# EasyEDA Pro project esp32_tools.eprj

# Schematic Schematic1
Create Date: 2024-05-25; Page Name: P1; Project Name: esp32_tools; Schematic Name: Schematic1; Update Date: 2024-06-01; Company: 嘉立创EDA; Page Size: A4; Version: V1.0
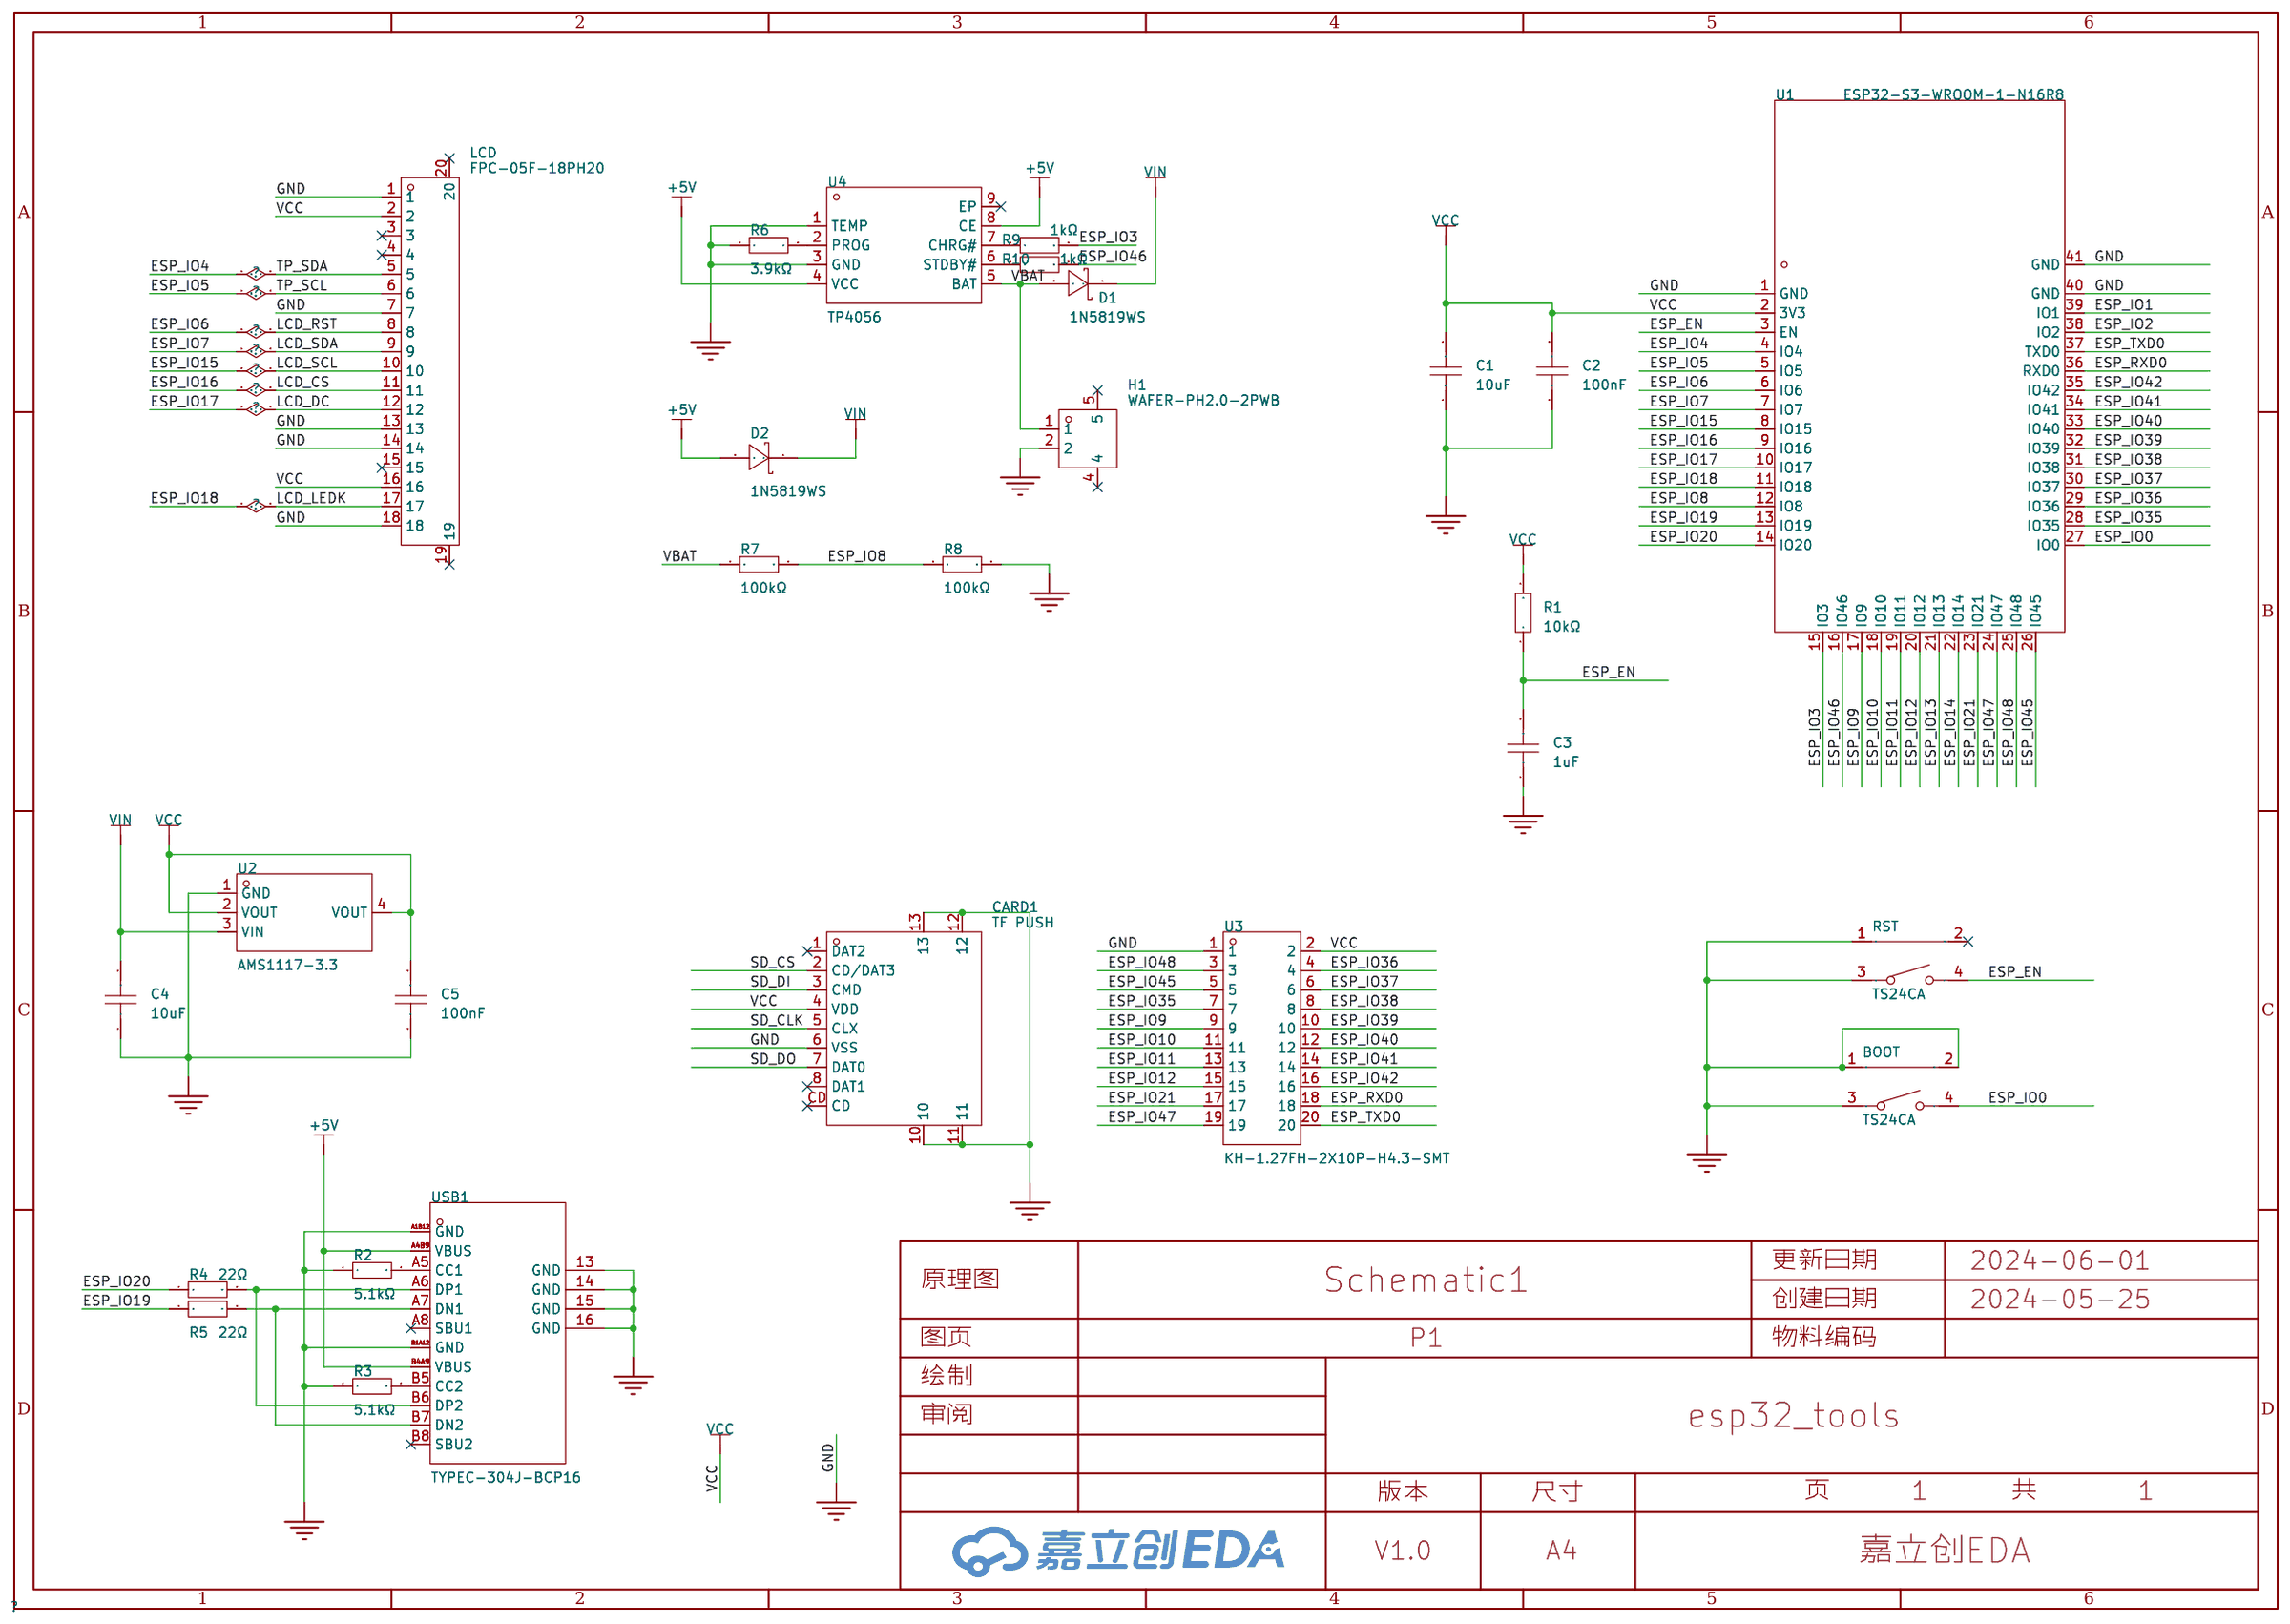
[diagram p0: schematic sheet]

## Parts
BOOT  TS24CA  [SW-SMD_TS24CA]
C1  10uF  [C0603]
C2  100nF  [C0603]
C3  1uF  [C0603]
C4  10uF  [C0603]
C5  100nF  [C0603]
CARD1  TF PUSH  [TF-SMD_TF-PUSH]
D1  1N5819WS  [SOD-323_L1.8-W1.3-LS2.5-RD]
D2  1N5819WS  [SOD-323_L1.8-W1.3-LS2.5-RD]
H1  WAFER-PH2.0-2PWB  [CONN-SMD_2P-P2.00_XUNPU_WAFER-PH2.0-2PWB]
LCD  FPC-05F-18PH20  [FPC-SMD_18P-P0.50_FPC-05F-18PH20]
R1  10kΩ  [R0603]
R2  5.1kΩ  [R0603]
R3  5.1kΩ  [R0603]
R4  22Ω  [R0603]
R5  22Ω  [R0603]
R6  3.9kΩ  [R0603]
R7  100kΩ  [R0603]
R8  100kΩ  [R0603]
R9  1kΩ  [R0603]
R10  1kΩ  [R0603]
RST  TS24CA  [SW-SMD_TS24CA]
U1  ESP32-S3-WROOM-1-N16R8  [WIRELM-SMD_ESP32-S3-WROOM-1]
U2  AMS1117-3.3  [SOT-223-3_L6.5-W3.4-P2.30-LS7.0-BR]
U3  KH-1.27FH-2X10P-H4.3-SMT  [CONN-SMD_20P-P1.27_KINGHELM_KH-1.27FH-2X10P-H4.3-SMT]
U4  TP4056  [ESOP-8_L4.9-W3.9-P1.27-LS6.0-BL-EP]
USB1  TYPEC-304J-BCP16  [USB-C-SMD_TYPEC-304J-BCP16]

## Library data of the parts
BOOT RST = TS24CA: 电路结构:单刀单掷;按钮形状:矩形按钮;安装方式:卧贴;开关长度:4.55mm;开关宽度:1.8mm;开关高度:3.5mm;触点电流:50mA;额定电压(DC):12V;带灯:-;机械寿命:-;; LCSC Part Name: 4.55*1.8*3.5mm 卧贴 轻触开关; Supplier Part: C393942; Manufacturer: SHOU HAN(首韩); Supplier Footprint: SMD; JLCPCB Part Class: 扩展库; Datasheet: https://atta.szlcsc.com/upload/public/pdf/source/20190521/C393942_591A9E318887EFA4274D34029981AD99.pdf; Supplier: LCSC; Circuit: 单刀单掷; Actuator Style: 矩形按钮; Mounting Style: 卧贴; Switch Length: 4.55mm; Switch Width: 1.8mm; Switch Height: 3.5mm; Contact Current: 50mA; Voltage Rating (DC): 12V
C1 = CL10A106MQ8NNNC: 容值:10uF;精度:±20%;额定电压:6.3V;材质(温度系数):X5R;; LCSC Part Name: 10uF ±20% 6.3V; Supplier Part: C1691; Manufacturer: SAMSUNG(三星); Supplier Footprint: 0603; JLCPCB Part Class: 扩展库; Datasheet: https://atta.szlcsc.com/upload/public/pdf/source/20160218/1457707763339.pdf; Supplier: LCSC; Tolerance: ±20%; Voltage Rated: 6.3V; Temperature Coefficient: X5R
C2 C5 = CC0603KRX7R9BB104: 容值:100nF;精度:±10%;额定电压:50V;材质(温度系数):X7R;; LCSC Part Name: 100nF ±10% 50V; Supplier Part: C14663; Manufacturer: YAGEO(国巨); Supplier Footprint: 0603; JLCPCB Part Class: 基础库; Datasheet: https://atta.szlcsc.com/upload/public/pdf/source/20180910/C282072_33301C7F631E79921B82A8DAC6BCC5B3.pdf; Supplier: LCSC; Tolerance: ±10%; Voltage Rated: 50V; Temperature Coefficient: X7R
C3 = CL10A105KB8NNNC: 容值:1uF;精度:±10%;额定电压:50V;材质(温度系数):X5R;; LCSC Part Name: 1uF ±10% 50V; Supplier Part: C15849; Manufacturer: SAMSUNG(三星); Supplier Footprint: 0603; JLCPCB Part Class: 基础库; Datasheet: https://atta.szlcsc.com/upload/public/pdf/source/20160218/1457707763339.pdf; Supplier: LCSC; Tolerance: ±10%; Voltage Rated: 50V; Temperature Coefficient: X5R
C4 = CL10A106MA8NRNC: 容值:10uF;精度:±20%;额定电压:25V;材质(温度系数):X5R;; LCSC Part Name: 10uF ±20% 25V; Supplier Part: C96446; Manufacturer: SAMSUNG(三星); Supplier Footprint: 0603; JLCPCB Part Class: 基础库; Datasheet: https://atta.szlcsc.com/upload/public/pdf/source/20160218/1457707763339.pdf; Supplier: LCSC; Tolerance: ±20%; Voltage Rated: 25V; Temperature Coefficient: X5R
CARD1 = TF PUSH: 卡连接方式:自弹式;卡类型:MicroSD卡(TF卡);连接器类型:卡座;本体最大高度:2mm;触头材质:-;触头镀层:-;工作温度范围:-20℃~+90℃;焊接温度(最大值):-;; LCSC Part Name: 自弹式 MicroSD卡(TF卡) 卡座; Supplier Part: C393941; Manufacturer: SHOU HAN(首韩); Supplier Footprint: SMD; JLCPCB Part Class: 扩展库; Datasheet: https://atta.szlcsc.com/upload/public/pdf/source/20191011/C393941_0DDD896EE907FEB750D8B7B8982E2A67.pdf; Supplier: LCSC; Card Connection Mode: 自弹式; Card Type: MicroSD卡(TF卡); Connector Type: 卡座; Maximum Body Height: 2mm; Operating Temperature Range: -20℃~+90℃; Additional Card Detection Pins: 无
D1 D2 = 1N5819WS_C191023: 正向压降(Vf):600mV@1A;直流反向耐压(Vr):40V;平均整流电流(Io):1A;; LCSC Part Name: 电压:40V 电流:1A; Supplier Part: C191023; Manufacturer: Hottech(合科泰); Supplier Footprint: SOD-323; JLCPCB Part Class: 基础库; Datasheet: https://atta.szlcsc.com/upload/public/pdf/source/20220428/3CB86FD8D28D653594B4E35F9D5AEFD9.pdf; Supplier: LCSC; Forward Voltage (Vf@If): 600mV@1A; Reverse Voltage (Vr): 40V; Average Rectified Current (Io): 1A
H1 = WAFER-PH2.0-2PWB: 插针结构:1x2P;间距:2mm;安装方式:卧贴;总PIN数:2P;排数:1;每排PIN数:2;额定电流:2A;工作温度范围:-25℃~+85℃;; LCSC Part Name: 1x2P 间距:2mm 卧贴; Supplier Part: C3029440; Manufacturer: XUNPU(讯普); Supplier Footprint: SMD,P=2mm,卧贴; JLCPCB Part Class: 扩展库; Datasheet: https://atta.szlcsc.com/upload/public/pdf/source/20220527/83903C18429EFE4C9EEE8C529A248431.pdf; Supplier: LCSC; Pins Structure: 1x2P; Pitch: 2mm; Mounting Style: 卧贴; Number of Pins: 2P; Number of Rows: 1; Number of PINs Per Row: 2; Current Rating (Max): 2A; Operating Temperature Range: -25℃~+85℃
LCD = FPC-05F-18PH20: 锁定特性:翻盖式;触点类型:下接;触点数量:18P;间距:0.5mm;安装类型:卧贴;工作温度范围:-25℃~+85℃;; LCSC Part Name: 间距:0.5mm P数:18P 翻盖式 下接; Supplier Part: C2856802; Manufacturer: XUNPU(讯普); Supplier Footprint: SMD,P=0.5mm,卧贴; JLCPCB Part Class: 扩展库; Datasheet: https://atta.szlcsc.com/upload/public/pdf/source/20210922/C2856802_2A845D1961F33AEC1ED22CECB292335F.pdf; Supplier: LCSC; Locking Feature: 翻盖式; Contact Type: 下接; Number of Contacts: 18P; Pitch: 0.5mm; Mounting Type: 卧贴; FFC, FCB Thickness: 0.3mm; Height Above Board: 2mm; Operating Temperature Range: -25℃~+85℃
R1 = 0603WAF1002T5E: 电阻类型:厚膜电阻;阻值:10kΩ;精度:±1%;功率:100mW;最大工作电压:75V;温度系数:±100ppm/℃;; LCSC Part Name: 厚膜电阻 10kΩ ±1% 100mW; Supplier Part: C25804; Manufacturer: UNI-ROYAL(厚声); Supplier Footprint: 0603; JLCPCB Part Class: 基础库; Datasheet: https://atta.szlcsc.com/upload/public/pdf/source/20200306/C422600_1E6D84923E4A46A82E41ADD87F860B5C.pdf; Supplier: LCSC; Type: 厚膜电阻; Tolerance: ±1%; Power(Watts): 100mW; Overload Voltage (Max): 75V; Temperature Coefficient: ±100ppm/℃; Operating Temperature Range: -55℃~+155℃
R2 R3 = 0603WAF5101T5E: 电阻类型:厚膜电阻;阻值:5.1kΩ;精度:±1%;功率:100mW;最大工作电压:75V;温度系数:±100ppm/℃;; LCSC Part Name: 5.1kΩ ±1% 100mW 厚膜电阻; Supplier Part: C23186; Manufacturer: UNI-ROYAL(厚声); Supplier Footprint: 0603; JLCPCB Part Class: 基础库; Datasheet: https://atta.szlcsc.com/upload/public/pdf/source/20200306/C422600_1E6D84923E4A46A82E41ADD87F860B5C.pdf; Supplier: LCSC; Type: 厚膜电阻; Tolerance: ±1%; Power(Watts): 100mW; Overload Voltage (Max): 75V; Temperature Coefficient: ±100ppm/℃; Operating Temperature Range: -55℃~+155℃
R4 R5 = 0603WAF220JT5E: 电阻类型:厚膜电阻;阻值:22Ω;精度:±1%;功率:100mW;最大工作电压:75V;温度系数:±100ppm/℃;; LCSC Part Name: 22Ω ±1% 100mW 厚膜电阻; Supplier Part: C23345; Manufacturer: UNI-ROYAL(厚声); Supplier Footprint: 0603; JLCPCB Part Class: 基础库; Datasheet: https://atta.szlcsc.com/upload/public/pdf/source/20200306/C422600_1E6D84923E4A46A82E41ADD87F860B5C.pdf; Supplier: LCSC; Type: 厚膜电阻; Tolerance: ±1%; Power(Watts): 100mW; Overload Voltage (Max): 75V; Temperature Coefficient: ±100ppm/℃; Operating Temperature Range: -55℃~+155℃
R6 = 0603WAF3901T5E: 电阻类型:厚膜电阻;阻值:3.9kΩ;精度:±1%;功率:100mW;最大工作电压:75V;温度系数:±100ppm/℃;; LCSC Part Name: 3.9kΩ ±1% 100mW 厚膜电阻; Supplier Part: C23018; Manufacturer: UNI-ROYAL(厚声); Supplier Footprint: 0603; JLCPCB Part Class: 基础库; Datasheet: https://atta.szlcsc.com/upload/public/pdf/source/20200306/C422600_1E6D84923E4A46A82E41ADD87F860B5C.pdf; Supplier: LCSC; Type: 厚膜电阻; Tolerance: ±1%; Power(Watts): 100mW; Overload Voltage (Max): 75V; Temperature Coefficient: ±100ppm/℃; Operating Temperature Range: -55℃~+155℃
R7 R8 = RC0603FR-07100KL: 电阻类型:厚膜电阻;阻值:100kΩ;精度:±1%;功率:100mW;最大工作电压:75V;温度系数:±100ppm/℃;; LCSC Part Name: 厚膜电阻 100kΩ ±1% 100mW; Supplier Part: C14675; Manufacturer: YAGEO(国巨); Supplier Footprint: 0603; JLCPCB Part Class: 扩展库; Datasheet: https://atta.szlcsc.com/upload/public/pdf/source/20140324/1457707028752.pdf; Supplier: LCSC; Type: 厚膜电阻; Tolerance: ±1%; Power(Watts): 100mW; Overload Voltage (Max): 75V; Temperature Coefficient: ±100ppm/℃; Operating Temperature Range: -55℃~+155℃
R9 R10 = RC0603FR-071KL: 电阻类型:厚膜电阻;阻值:1kΩ;精度:±1%;功率:100mW;最大工作电压:75V;温度系数:±100ppm/℃;; LCSC Part Name: 厚膜电阻 1kΩ ±1% 100mW; Supplier Part: C22548; Manufacturer: YAGEO(国巨); Supplier Footprint: 0603; JLCPCB Part Class: 扩展库; Datasheet: https://atta.szlcsc.com/upload/public/pdf/source/20180316/70C0E2BDAE7FCC62C531A5A58D202EE1.pdf; Supplier: LCSC; Type: 厚膜电阻; Tolerance: ±1%; Power(Watts): 100mW; Overload Voltage (Max): 75V; Temperature Coefficient: ±100ppm/℃; Operating Temperature Range: -55℃~+155℃
U1 = ESP32-S3-WROOM-1-N16R8: LCSC Part Name: 通用型Wi-Fi+低功耗蓝牙MCU模组; Supplier Part: C2913202; Manufacturer: ESPRESSIF(乐鑫); Supplier Footprint: SMD,18x25.5mm; JLCPCB Part Class: 扩展库; Datasheet: https://atta.szlcsc.com/upload/public/pdf/source/20220705/4E799F39581577F766659887F738A439.pdf; Supplier: LCSC
U2 = AMS1117-3.3_C6186: 输出类型:固定;最大输入电压:-;输出电压:3.3V;最大输出电流:1A;电源纹波抑制比(PSRR):72dB@(120Hz);输出极性:正极;; LCSC Part Name: 输出3.3V 1A; Supplier Part: C6186; Manufacturer: AMS; Supplier Footprint: SOT-223-3; JLCPCB Part Class: 基础库; Datasheet: https://atta.szlcsc.com/upload/public/pdf/source/20180727/C6186_7A095716F0823C02F1997A905E26C086.pdf; Supplier: LCSC; Output Type: 固定; Output Voltage: 3.3V; MAX Output Current: 1A; Power Supply Rejection Ratio (PSRR): 72dB@(120Hz); Dropout Voltage: 1.3V@(800mA); Output Polarity: 正极; Number of Outputs: 1
U3 = KH-1.27FH-2X10P-H4.3-SMT: 插孔结构:2x10P;间距:1.27mm;行距:1.27mm;圆孔/方孔:方孔;安装类型:立贴;排数:双排;总孔位数:20P;额定电流:1A;额定电压:-;插孔方向:顶部;塑高:4.3mm;工作温度范围:-40℃~+105℃;; LCSC Part Name: 间距:1.27mm 2x10P 立贴; Supplier Part: C2938399; Manufacturer: kinghelm(金航标); Supplier Footprint: SMD,P=1.27mm; JLCPCB Part Class: 扩展库; Datasheet: https://atta.szlcsc.com/upload/public/pdf/source/20211228/9EED874CCD66E53FBD3960CA18E93ED0.pdf; Supplier: LCSC; Holes Structure: 2x10P; Pitch: 1.27mm; Row Spacing: 1.27mm; Circular Hole / Square Hole: 方孔; Mounting Type: 立贴; Number of Rows: 双排; Number of Holes: 20P; Current Rating (Max): 1A; Holes Direction: 顶部; Insulation Height: 4.3mm; Operating Temperature Range: -40℃~+105℃
U4 = TP4056_C725790: Supplier Part: C725790; Manufacturer: UMW(友台半导体); Supplier Footprint: ESOP-8; JLCPCB Part Class: 扩展库; Datasheet: https://atta.szlcsc.com/upload/public/pdf/source/20231109/CF74897CE79A500F7FE27A45ADCCC631.pdf; Supplier: LCSC
USB1 = TYPEC-304J-BCP16: 连接器类型:Type-C;标准:USB 3.1;公母:母;端口数量:1;触点数量:16P;安装方式:卧贴;额定电流 - 电源:5A;工作温度范围:-40℃~+85℃;焊接温度(最大值):260℃;; LCSC Part Name: Type-C 母 卧贴; Supplier Part: C2835315; Manufacturer: XUNPU(讯普); Supplier Footprint: SMD; JLCPCB Part Class: 扩展库; Datasheet: https://atta.szlcsc.com/upload/public/pdf/source/20210528/C2835315_A76BD3CF9329D12B6041421AD23BFD66.pdf; Supplier: LCSC; Connector Type: Type-C; Standard: USB 3.1; Gender: 母; Number of Ports: 1; Number of Contacts: 16P; Mounting Style: 卧贴; Current Rating - Power (Max): 5A; Operating Temperature Range: -40℃~+85℃; Soldering Temperature(Max): 260℃

## Nets
+5V: D2.2(A) U4.4(VCC) U4.8(CE) USB1.A4B9(VBUS) USB1.B4A9(VBUS)
GND: BOOT.1 BOOT.2 BOOT.3 C1.1 C2.1 C3.1 C4.1 C5.1 CARD1.6(VSS) CARD1.10 CARD1.11 CARD1.12 CARD1.13 H1.2 LCD.1 LCD.7 LCD.13 LCD.14 LCD.18 R2.1 R3.1 R6.1 R8.2 RST.1 RST.3 U1.1(GND) U1.40(GND) U1.41(GND) U2.1(GND) U3.1 U4.1(TEMP) U4.3(GND) USB1.13(GND) USB1.14(GND) USB1.15(GND) USB1.16(GND) USB1.A1B12(GND) USB1.B1A12(GND)
VBAT: D1.2(A) H1.1 R7.1 U4.5(BAT)
VCC: C1.2 C2.2 C5.2 CARD1.4(VDD) LCD.2 LCD.16 R1.2 U1.2(3V3) U2.2(VOUT) U2.4(VOUT) U3.2
VIN: C4.2 D1.1(K) D2.1(K) U2.3(VIN)
ESP_EN: C3.2 R1.1 RST.4 U1.3(EN)
ESP_IO0: BOOT.4 U1.27(IO0)
ESP_IO1: U1.39(IO1)
ESP_IO2: U1.38(IO2)
ESP_IO3: R9.2 U1.15(IO3)
ESP_IO4: LCD.5 U1.4(IO4)
ESP_IO5: LCD.6 U1.5(IO5)
ESP_IO6: LCD.8 U1.6(IO6)
ESP_IO7: LCD.9 U1.7(IO7)
ESP_IO8: R7.2 R8.1 U1.12(IO8)
ESP_IO9: U1.17(IO9) U3.9
ESP_IO10: U1.18(IO10) U3.11
ESP_IO11: U1.19(IO11) U3.13
ESP_IO12: U1.20(IO12) U3.15
ESP_IO13: U1.21(IO13)
ESP_IO14: U1.22(IO14)
ESP_IO15: LCD.10 U1.8(IO15)
ESP_IO16: LCD.11 U1.9(IO16)
ESP_IO17: LCD.12 U1.10(IO17)
ESP_IO18: LCD.17 U1.11(IO18)
ESP_IO19: R5.1 U1.13(IO19)
ESP_IO20: R4.1 U1.14(IO20)
ESP_IO21: U1.23(IO21) U3.17
ESP_IO35: U1.28(IO35) U3.7
ESP_IO36: U1.29(IO36) U3.4
ESP_IO37: U1.30(IO37) U3.6
ESP_IO38: U1.31(IO38) U3.8
ESP_IO39: U1.32(IO39) U3.10
ESP_IO40: U1.33(IO40) U3.12
ESP_IO41: U1.34(IO41) U3.14
ESP_IO42: U1.35(IO42) U3.16
ESP_IO45: U1.26(IO45) U3.5
ESP_IO46: R10.2 U1.16(IO46)
ESP_IO47: U1.24(IO47) U3.19
ESP_IO48: U1.25(IO48) U3.3
ESP_RXD0: U1.36(RXD0) U3.18
ESP_TXD0: U1.37(TXD0) U3.20
SD_CLK: CARD1.5(CLX)
SD_CS: CARD1.2(CD/DAT3)
SD_DI: CARD1.3(CMD)
SD_DO: CARD1.7(DAT0)
$1N2450: R2.2 USB1.A5(CC1)
$1N2489: R3.2 USB1.B5(CC2)
$1N2560: R5.2 USB1.A7(DN1) USB1.B7(DN2)
$1N2569: R4.2 USB1.A6(DP1) USB1.B6(DP2)
$1N7946: R6.2 U4.2(PROG)
$1N8576: R9.1 U4.7(CHRG#)
$1N8615: R10.1 U4.6(STDBY#)

Not connected (* = marked no-connect by the designer): CARD1 1(DAT2)* 8(DAT1)* CD*; H1 4* 5*; LCD 3* 4* 15* 19* 20*; RST 2*; U4 9(EP)*; USB1 A8(SBU1)* B8(SBU2)*

# Board PCB1
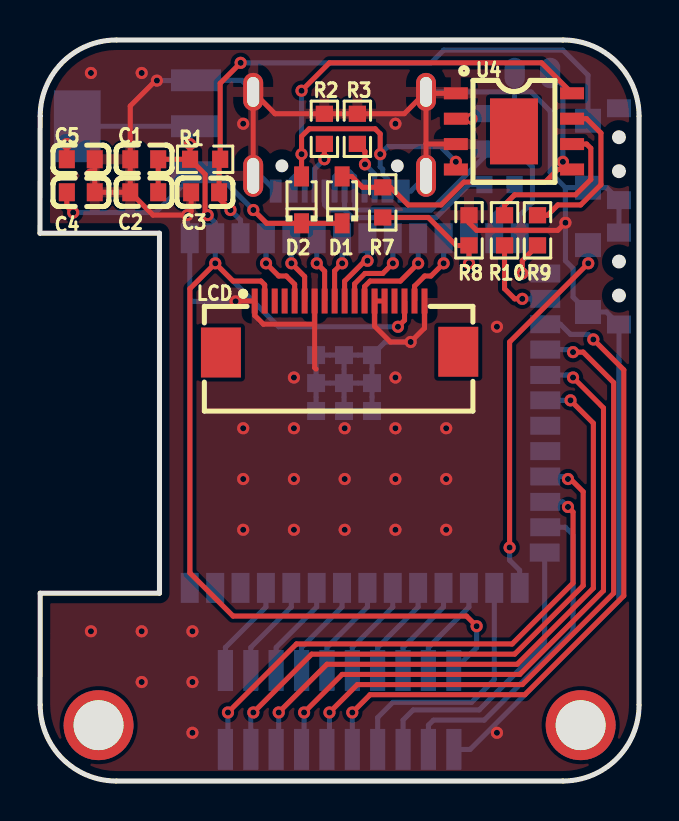
[diagram p1: board, top side]
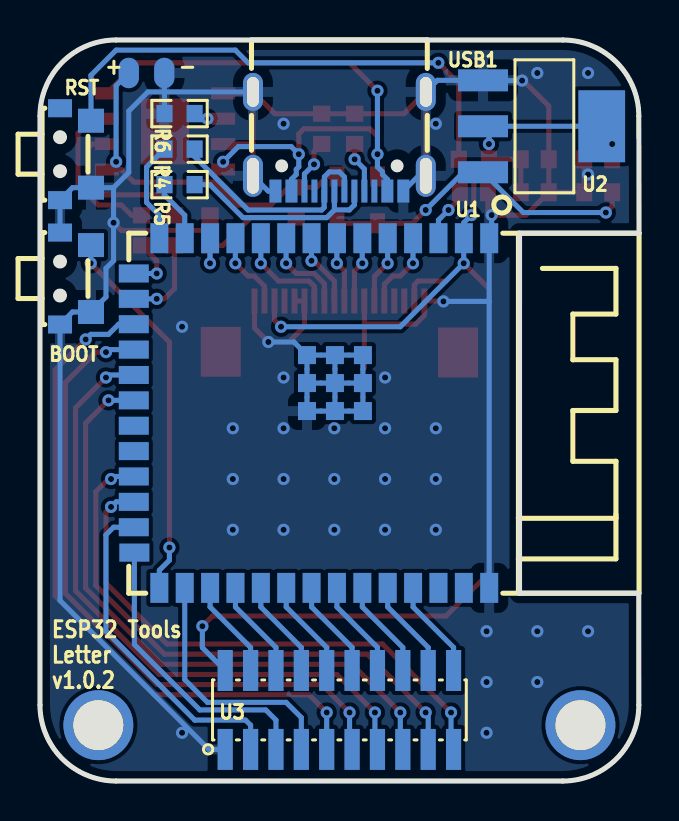
[diagram p2: board, bottom side, seen from below]

Outline 29.99 x 37.09 mm; copper layers: Top Layer, Bottom Layer. Coordinates in mm from the lower left corner of the outline.
Outline path: 0,27.42 0.01,33.28 arc(1.13,35.97) 3.82,37.09 26.18,37.09 arc(28.87,35.97) 29.99,33.28 29.99,3.81 arc(28.87,1.12) 26.18,0 3.82,0 arc(1.13,1.12) 0.01,3.81 0.01,9.4 5.98,9.4 5.98,27.42 0,27.42
Stack: Top Layer 0.035mm / Dielectric1 1.51mm FR4 er 4.5 / Bottom Layer 0.035mm

## Design rules (mm)
template: 自定义配置
spacing copperThickness1oz (default): track to track 0.102, other pairs 0.152 to 0.3
spacing copperThickness2oz: track to track 0.203, other pairs 0.152 to 0.3
track width copperThickness1oz (default): min 0.127, default 0.254, max 2.54
track width copperThickness2oz: min 0.203, default 0.254, max 2.54
differential pair differentialPair (default): width min 0.127, default 0.254, max 2.54; gap min 0.152, default 0.152
via viaSize (default): diameter min 0.5, default 0.61, max 35; hole min 0.3, default 0.305, max 45

## Placement (name value [footprint] x y rotation side)
BOOT  TS24CA  [SW-SMD_TS24CA]  28.21 25.15 90 bottom
C1  10uF  [C0603]  5.22 31.12 0 top
C2  100nF  [C0603]  5.22 29.47 0 top
C3  1uF  [C0603]  8.27 29.47 0 top
C4  10uF  [C0603]  2.04 29.47 180 top
C5  100nF  [C0603]  2.04 31.12 180 top
D1  1N5819WS  [SOD-323_L1.8-W1.3-LS2.5-RD]  15.12 29.08 90 top
D2  1N5819WS  [SOD-323_L1.8-W1.3-LS2.5-RD]  13.09 29.08 90 top
LCD  FPC-05F-18PH20  [FPC-SMD_18P-P0.50_FPC-05F-18PH20]  15 22.73 0 top
NOREF  -  [Pad_e707]  25.54 35.43 0 top
NOREF#2  -  [Pad_e46]  2.93 2.8 0 top
NOREF#3  -  [Pad_e709]  23.76 35.43 0 top
NOREF#4  -  [Pad_e149]  27.06 2.8 0 top
R1  10kΩ  [R0603]  8.27 31.12 180 top
R2  5.1kΩ  [R0603]  14.24 32.64 270 top
R3  5.1kΩ  [R0603]  15.89 32.64 270 top
R4  22Ω  [R0603]  23 31.62 180 bottom
R5  22Ω  [R0603]  23 29.85 180 bottom
R6  3.9kΩ  [R0603]  23 33.4 180 bottom
R7  100kΩ  [R0603]  17.16 28.96 270 top
R8  100kΩ  [R0603]  21.47 27.56 90 top
R9  1kΩ  [R0603]  24.9 27.56 270 top
R10  1kΩ  [R0603]  23.25 27.56 270 top
RST  TS24CA  [SW-SMD_TS24CA]  28.21 31.37 90 bottom
U1  ESP32-S3-WROOM-1-N16R8  [WIRELM-SMD_ESP32-S3-WROOM-1]  16.4 18.42 270 bottom
U2  AMS1117-3.3  [SOT-223-3_L6.5-W3.4-P2.30-LS7.0-BR]  4.84 32.77 0 bottom
U3  KH-1.27FH-2X10P-H4.3-SMT  [CONN-SMD_20P-P1.27_KINGHELM_KH-1.27FH-2X10P-H4.3-SMT]  15 3.56 180 bottom
U4  TP4056  [ESOP-8_L4.9-W3.9-P1.27-LS6.0-BL-EP]  23.72 32.51 270 top
USB1  TYPEC-304J-BCP16  [USB-C-SMD_TYPEC-304J-BCP16]  15 32.01 0 bottom

## Footprints (pads in the part's own frame, mm; a bottom-side part is the same pattern mirrored in y, then rotated)
C0603
  rect 0.8x0.9 smd: 1(-0.7,0) 2(0.7,0)
CONN-SMD_20P-P1.27_KINGHELM_KH-1.27FH-2X10P-H4.3-SMT
  rect 0.76x2.05 smd: 1(-5.715,-1.975) 2(-5.715,1.975) 3(-4.445,-1.975) 4(-4.445,1.975) 5(-3.175,-1.975) 6(-3.175,1.975) 7(-1.905,-1.975) 8(-1.905,1.975) 9(-0.635,-1.975) 10(-0.635,1.975) 11(0.635,-1.975) 12(0.635,1.975) 13(1.905,-1.975) 14(1.905,1.975) 15(3.175,-1.975) 16(3.175,1.975) 17(4.445,-1.975) 18(4.445,1.975) 19(5.715,-1.975) 20(5.715,1.975)
ESOP-8_L4.9-W3.9-P1.27-LS6.0-BL-EP
  rect 0.6x1.2 smd: 1(-1.905,-2.909) 2(-0.635,-2.909) 3(0.635,-2.909) 4(1.905,-2.909) 5(1.905,2.909) 6(0.635,2.909) 7(-0.635,2.909) 8(-1.905,2.909)
  rect 3.3x2.4 smd: 9(0,0)
FPC-SMD_18P-P0.50_FPC-05F-18PH20
  rect 0.3x1.25 smd: 1(-4.25,1.288) 2(-3.75,1.288) 3(-3.25,1.288) 4(-2.75,1.288) 5(-2.25,1.288) 6(-1.75,1.288) 7(-1.25,1.288) 8(-0.75,1.288) 9(-0.25,1.288) 10(0.25,1.288) 11(0.75,1.288) 12(1.25,1.288) 13(1.75,1.288) 14(2.25,1.288) 15(2.75,1.288) 16(3.25,1.288) 17(3.75,1.288) 18(4.25,1.288)
  rect 2x2.5 smd: 19(-5.94,-1.288) 20(5.94,-1.252)
Pad_e46
  round 3.5 hole 2.5: 42(0,0)
Pad_e149
  round 3.5 hole 2.5: 42(0,0)
Pad_e707
  oval 1.016x1.524 smd far side: 1(0,0)
Pad_e709
  oval 1.016x1.524 smd far side: 1(0,0)
R0603
  rect 0.806x0.864 smd: 1(-0.753,0) 2(0.753,0)
SOD-323_L1.8-W1.3-LS2.5-RD
  rect 1x0.75 smd: 1(-1.173,0) 2(1.173,0)
SOT-223-3_L6.5-W3.4-P2.30-LS7.0-BR
  rect 2.5x1.1 smd: 1(2.97,-2.3) 2(2.97,0) 3(2.97,2.3)
  rect 2.34x3.6 smd: 4(-2.97,0)
SW-SMD_TS24CA
  rect 0.9x1.2 smd: 1(-2.3,0.775) 2(2.3,0.775)
  rect 1.2x1.3 smd: 3(-1.675,-0.775) 4(1.675,-0.775)
USB-C-SMD_TYPEC-304J-BCP16
  oval 1x2.1 hole 0.6x1.8: 13(-4.325,1.718) 14(4.325,1.718)
  oval 1x1.9 hole 0.6x1.5: 15(-4.325,-2.482) 16(4.325,-2.482)
  rect 0.6x1.15 smd: A1B12(-3.2,2.482) A4B9(-2.4,2.482) B1A12(3.2,2.482) B4A9(2.4,2.482)
  rect 0.3x1.15 smd: A5(-1.25,2.482) A6(-0.25,2.482) A7(0.25,2.482) A8(1.25,2.482) B5(1.75,2.482) B6(0.75,2.482) B7(-0.75,2.482) B8(-1.75,2.482)
WIRELM-SMD_ESP32-S3-WROOM-1
  rect 1.5x0.9 smd: 1(-8.75,8.895) 2(-8.75,7.625) 3(-8.75,6.355) 4(-8.75,5.085) 5(-8.75,3.815) 6(-8.75,2.545) 7(-8.75,1.275) 8(-8.75,0.005) 9(-8.75,-1.265) 10(-8.75,-2.535) 11(-8.75,-3.805) 12(-8.75,-5.075) 13(-8.75,-6.345) 14(-8.75,-7.615) 27(8.75,-7.615) 28(8.75,-6.345) 29(8.75,-5.075) 30(8.75,-3.805) 31(8.75,-2.535) 32(8.75,-1.265) 33(8.75,0.005) 34(8.75,1.275) 35(8.75,2.545) 36(8.75,3.815) 37(8.75,5.085) 38(8.75,6.355) 39(8.75,7.625) 40(8.75,8.895)
  rect 0.9x1.5 smd: 15(-6.985,-8.895) 16(-5.715,-8.895) 17(-4.445,-8.895) 18(-3.175,-8.895) 19(-1.905,-8.895) 20(-0.635,-8.895) 21(0.635,-8.895) 22(1.905,-8.895) 23(3.175,-8.895) 24(4.445,-8.895) 25(5.715,-8.895) 26(6.985,-8.865)
  rect 0.9x0.9 smd: 41(-2.9,-0.225) 41(-2.9,1.175) 41(-2.9,2.575) 41(-1.5,-0.225) 41(-1.5,1.175) 41(-1.5,2.575) 41(-0.1,-0.225) 41(-0.1,1.175) 41(-0.1,2.575)

## Nets
As in the schematic, except:
GND: BOOT.1 BOOT.2 BOOT.3 C1.1 C2.1 C3.1 C4.1 C5.1 LCD.1 LCD.7 LCD.13 LCD.14 LCD.18 NOREF#3.1 R2.1 R3.1 R6.1 R8.2 RST.1 RST.3 U1.1 U1.40 U1.41 U2.1 U3.1 U4.1 U4.3 USB1.13 USB1.14 USB1.15 USB1.16 USB1.A1B12 USB1.B1A12
VBAT: D1.2 NOREF.1 R7.1 U4.5

Pads without a net: LCD 3 4 15 19 20; NOREF#2 42; NOREF#4 42; RST 2; U4 9; USB1 A8 B8

## Via types
v1: diameter 0.61, hole 0.305, Top Layer to Bottom Layer, 78 vias

## Routing (per net, layer and track width the routed paths; a pad name or vN(x,y) marks a point on that pad's centre or on a via; arc(x,y) is an arc through that point)
+5V: length 33.8
  Top Layer w0.254: U4.4 v1(20.82,30.99) ; v1(13.09,34.55) 14.49,35.94 25.11,35.94 U4.8 ; v1(17.03,31.37) 17.03,32.39 16.78,32.64 13.47,32.64 13.09,32.26 v1(13.09,31.37) D2.2
  Bottom Layer w0.254: v1(20.82,30.99) 20.06,31.75 17.41,31.75 v1(17.03,31.37) 17.03,30.74 17.16,30.61 17.16,30.35 17.4,30.11 USB1.B4A9 ; USB1.A4B9 12.59,29.54 12.59,30.1 12.84,30.35 12.84,30.48 13.09,30.74 v1(13.09,31.37) v1(13.09,34.55)
GND: length 154.1
  Top Layer w0.254: USB1.13 USB1.15 11.77,33.39 R2.1 R3.1 18.23,33.39 19.32,34.49 ; 13.75,22.86 13.75,20.69 13.82,20.62 ; 13.75,22.86 13.74,22.86 11.19,22.86 10.75,23.3 LCD.1 9.81,24.02 v1(9.79,24) ; 13.75,22.86 LCD.7 ; U4.1 19.39,34.42 19.32,34.49 ; C3.1 7.57,28.51 v1(7.38,28.32) 5.66,28.32 C2.1 ; C5.1 C4.1 C2.1 ; v1(5.85,35.05) 5.79,35.05 4.52,33.78 C1.1 C2.1 ; 19.32,31.89 19.34,31.88 U4.3 ; 19.32,31.89 19.32,30.29 ; 19.32,31.89 19.32,34.49 ; R8.2 21.47,27.94 21.86,27.56 25.92,27.56 v1(26.3,27.94) ; LCD.18 19.25,22.67 v1(18.55,21.97) 17.54,21.97 16.75,22.76 LCD.13 LCD.14
  Bottom Layer w0.254: U1.41 U1.41 U1.41 ; U1.41 U1.41 ; U1.41 U1.41 U1.41 ; 23.76,34.49 23.76,34.48 23.75,34.47 R6.1 ; 23.76,34.49 NOREF#3.1 ; 23.76,34.49 24.58,34.49 25.54,33.53 25.54,30.46 26.3,29.7 ; U1.41 U1.41 ; U1.41 U1.41 ; U1.41 17.28,21.97 v1(18.55,21.97) ; U1.41 U1.41 U1.41 ; U1.41 U1.41 ; U1.41 U1.41 ; v1(7.38,28.32) 7.38,27.29 U1.1 7.5,24 ; 23.74,34.49 19.32,34.49 ; 26.3,29.7 28.36,29.7 RST.1 BOOT.2 ; 26.3,29.7 v1(26.3,27.94) 26.3,26.04 26.68,25.66 26.68,24.22 27.43,23.47 28.36,23.47 BOOT.1 28.98,9.03 21.53,1.58 U3.1 ; U1.41 U1.41 ; v1(9.79,24) 7.5,24 ; 7.5,24 U1.40 ; USB1.B1A12 18.56,29.52 19.32,30.29 ; USB1.A1B12 11.03,30.29 USB1.13 ; USB1.15 10.09,35.07 U2.1 7.79,35.05 v1(5.85,35.05)
  vias: v1(2.55,35.43) v1(2.55,30.35) v1(2.55,7.49) v1(5.09,35.43) v1(5.09,7.49) v1(5.09,4.95) v1(7.63,7.49) v1(7.63,4.95) v1(7.63,2.41) v1(10.17,32.89) v1(10.17,17.65) v1(10.17,15.11) v1(10.17,12.57) v1(12.71,20.19) v1(12.71,17.65) v1(12.71,15.11) v1(12.71,12.57) v1(15.25,17.65) v1(15.25,15.11) v1(15.25,12.57) v1(17.79,32.89) v1(17.79,20.19) v1(17.79,17.65) v1(17.79,15.11) v1(17.79,12.57) v1(20.33,17.65) v1(20.33,15.11) v1(20.33,12.57) v1(22.87,22.73) v1(22.87,2.41)
VBAT: length 18.1
  Top Layer w0.254: D1.2 15.6,30.26 16.15,29.71 R7.1 17.55,29.71 18.43,28.83 20.08,28.83 21.22,29.97 25.28,29.97 25.92,30.61 26.56,30.61 ; 26.56,30.61 U4.5 ; 26.56,30.61 v1(26.17,30.99)
  Bottom Layer w0.254: v1(26.17,30.99) 26.17,34.8 NOREF.1
VCC: length 68.3
  Top Layer w0.254: v1(8.39,28.32) 8.27,28.45 8.27,30.36 R1.2 ; R1.2 v1(7.51,31.88) ; R1.2 5.92,31.12 5.92,29.47 ; v1(21.86,7.75) 21.35,8.26 9.66,8.26 7.5,10.42 7.5,24.64 v1(8.78,25.91) 9.66,25.02 11.06,25.02 11.25,24.83 LCD.2 ; v1(17.92,22.73) 18.25,23.06 LCD.16 ; C5.2 v1(1.34,31.88)
  Bottom Layer w0.254: v1(8.39,28.32) 8.77,27.95 U1.2 8.78,27.16 v1(8.78,25.91) 11.95,22.73 v1(17.92,22.73) ; v1(1.34,31.88) 1.34,32.24 U2.4 U2.2 7.5,32.46 7.5,31.88 v1(7.51,31.88) ; 20.71,5.53 21.86,6.68 v1(21.86,7.75)
VIN: length 16.5
  Top Layer w0.254: C4.2 1.34,28.77 v1(1.66,28.45) ; D1.1 D2.1 11.34,27.91 v1(10.68,28.58)
  Bottom Layer w0.254: v1(10.68,28.58) 8.79,30.47 U2.3 5.79,28.45 v1(1.66,28.45)
ESP_EN: length 30.1
  Top Layer w0.254: v1(9.54,28.58) 8.97,29.15 8.97,31.06 R1.1 9.02,34.92 v1(10.04,35.94)
  Bottom Layer w0.254: v1(9.54,28.58) 10.04,28.07 U1.3 ; v1(10.04,35.94) 19.57,35.94 20.21,36.58 26.17,36.58 27.43,35.32 27.43,33.05
ESP_IO0: length 19
  Top Layer w0.254: v1(27.44,25.91) 23.51,21.97 v1(23.51,11.69)
  Bottom Layer w0.254: v1(23.51,11.69) 23.51,11.05 24.01,10.55 U1.27 ; v1(27.44,25.91) 27.44,26.81 27.43,26.82
ESP_IO3: length 2.9
  Top Layer w0.254: v1(24.14,25.4) 24.14,26.05 R9.2
  Bottom Layer w0.254: U1.15 v1(24.14,25.4)
ESP_IO4: length 4
  Top Layer w0.254: LCD.5 12.75,24.86 12.33,25.27 11.95,25.27 v1(11.31,25.91)
  Bottom Layer w0.254: v1(11.31,25.91) 11.31,27.16 U1.4
ESP_IO5: length 3.4
  Top Layer w0.254: LCD.6 13.25,25.25 v1(12.59,25.91)
  Bottom Layer w0.254: U1.5 12.59,27.16 v1(12.59,25.91)
ESP_IO6: length 3.3
  Top Layer w0.254: LCD.8 14.25,25.52 v1(13.85,25.91)
  Bottom Layer w0.254: U1.6 13.85,27.16 v1(13.85,25.91)
ESP_IO7: length 3.3
  Top Layer w0.254: v1(15.12,25.91) 14.75,25.53 LCD.9
  Bottom Layer w0.254: v1(15.12,25.91) 15.12,27.16 U1.7
ESP_IO8: length 7.1
  Top Layer w0.254: 21.47,26.8 21.47,26.79 v1(21.47,25.91) ; 21.47,26.8 R8.1 ; 21.47,26.8 20.84,26.8 19.43,28.2 R7.2
  Bottom Layer w0.254: v1(21.47,25.91) 21.47,27.16 U1.12
ESP_IO9: length 34
  Top Layer w0.254: v1(27.7,22.1) 29.22,20.58 29.22,9.27 24.27,4.32 16.52,4.32 v1(15.63,3.43)
  Bottom Layer w0.254: U1.17 26.05,22.86 26.56,22.35 27.44,22.35 v1(27.7,22.1) ; U3.9 v1(15.63,3.43)
ESP_IO10: length 33.2
  Top Layer w0.254: v1(26.68,21.46) 27.19,21.46 28.71,19.94 28.71,9.4 24.14,4.83 15.89,4.83 v1(14.49,3.43)
  Bottom Layer w0.254: U1.18 26.56,21.59 v1(26.68,21.46) ; U3.11 14.49,1.71 v1(14.49,3.43)
ESP_IO11: length 32.2
  Top Layer w0.254: v1(13.22,3.43) 15.12,5.34 24.01,5.34 28.21,9.53 28.21,18.67 v1(26.68,20.19)
  Bottom Layer w0.254: v1(26.68,20.19) 26.56,20.32 U1.19 ; U3.13 13.22,1.71 v1(13.22,3.43)
ESP_IO12: length 31.4
  Top Layer w0.254: v1(26.56,19.05) 27.7,17.91 27.7,9.65 23.89,5.84 14.36,5.84 v1(11.95,3.43)
  Bottom Layer w0.254: v1(26.56,19.05) U1.20 ; v1(11.95,3.43) 11.95,1.71 11.82,1.58
ESP_IO15: length 3.7
  Top Layer w0.254: v1(16.4,26.04) 16.27,26.04 15.25,25.02 LCD.10
  Bottom Layer w0.254: U1.8 16.4,27.16 v1(16.4,26.04)
ESP_IO16: length 4.5
  Top Layer w0.254: LCD.11 15.75,24.88 16.27,25.4 17.16,25.4 v1(17.66,25.91)
  Bottom Layer w0.254: U1.9 17.66,27.16 v1(17.66,25.91)
ESP_IO17: length 5.1
  Top Layer w0.254: v1(18.93,25.91) 18.04,25.02 16.52,25.02 16.25,24.75 LCD.12
  Bottom Layer w0.254: U1.10 v1(18.93,25.91)
ESP_IO18: length 3.9
  Top Layer w0.254: LCD.17 18.75,24.77 19.26,25.27 19.57,25.27 v1(20.21,25.91)
  Bottom Layer w0.254: v1(20.21,25.91) 20.21,27.16 U1.11
ESP_IO19: length 3.1
  Bottom Layer w0.254: U1.13 22.74,28.32 23.76,29.34 23.75,29.35 R5.1
ESP_IO20: length 5.1
  Bottom Layer w0.254: U1.14 24.01,27.17 24.01,28.32 24.65,28.96 24.65,30.73 R4.1
ESP_IO21: length 28
  Top Layer w0.254: v1(10.68,3.43) 13.6,6.35 23.76,6.35 27.19,9.78 27.19,14.48 26.56,15.11 v1(26.43,15.11)
  Bottom Layer w0.254: U1.23 26.3,15.24 v1(26.43,15.11) ; v1(10.68,3.43) 10.55,3.3 U3.17
ESP_IO35: length 12.8
  Bottom Layer w0.254: U1.28 22.74,5.08 21.6,3.94 17.66,3.94 16.9,3.18 U3.7
ESP_IO36: length 5
  Bottom Layer w0.254: 19.44,5.53 19.44,6.68 21.47,8.71 U1.29
ESP_IO37: length 5
  Bottom Layer w0.254: U1.30 20.2,8.71 18.17,6.68 18.17,5.53
ESP_IO38: length 5
  Bottom Layer w0.254: U1.31 18.93,8.71 16.9,6.68 16.9,5.53
ESP_IO39: length 5
  Bottom Layer w0.254: 15.63,5.53 15.63,6.68 17.66,8.71 U1.32
ESP_IO40: length 5
  Bottom Layer w0.254: U1.33 16.39,8.71 14.36,6.68 14.36,5.53
ESP_IO41: length 5
  Bottom Layer w0.254: 13.09,5.53 13.09,6.68 15.12,8.71 U1.34
ESP_IO42: length 5
  Bottom Layer w0.254: U1.35 13.85,8.71 11.82,6.68 11.82,5.53
ESP_IO45: length 14.7
  Bottom Layer w0.254: U1.26 25.26,6.83 21.98,3.56 18.68,3.56 18.17,3.05 U3.5
ESP_IO46: length 4.4
  Top Layer w0.254: v1(24.14,24.13) 23.76,24.13 23.25,24.64 R10.2
  Bottom Layer w0.254: v1(24.14,24.13) U1.16
ESP_IO47: length 27
  Top Layer w0.254: v1(26.43,13.72) 26.68,13.46 26.68,9.91 23.63,6.86 12.84,6.86 v1(9.41,3.43)
  Bottom Layer w0.254: v1(9.41,3.43) 9.41,1.71 U3.19 ; v1(26.43,13.72) 26.17,13.97 U1.24
ESP_IO48: length 16.8
  Bottom Layer w0.254: U1.25 26.3,12.7 26.68,12.32 26.68,7.49 22.24,3.05 19.7,3.05 19.44,2.8 19.44,1.58
ESP_RXD0: length 5
  Bottom Layer w0.254: 10.55,5.53 10.55,6.68 12.58,8.71 U1.36
ESP_TXD0: length 5
  Bottom Layer w0.254: U1.37 11.31,8.71 9.28,6.68 9.28,5.53
$1N2450: length 2.6
  Top Layer w0.254: v1(14.24,31.12) R2.2
  Bottom Layer w0.254: USB1.A5 13.75,30.63 v1(14.24,31.12)
$1N2489: length 2.7
  Top Layer w0.254: R3.2 16.27,31.51 v1(16.27,30.86)
  Bottom Layer w0.254: v1(16.27,30.86) 16.75,30.38 USB1.B5
$1N2560: length 10.6
  Bottom Layer w0.254: R5.2 21.47,29.85 19.82,28.2 15.63,28.2 15.25,28.58 ; 15.25,28.58 14.5,28.58 14.25,28.83 USB1.B7 ; 15.25,28.58 USB1.A7
$1N2569: length 11.5
  Bottom Layer w0.254: USB1.A6 14.74,29.53 14.74,30.23 15,30.48 15.51,30.48 15.75,30.24 USB1.B6 15.76,29.51 15.76,28.7 15.89,28.58 19.57,28.58 22.25,31.25 R4.2
$1N7946: length 1.5
  Top Layer w0.254: U4.2 21.6,33.15 v1(21.6,33.15)
  Bottom Layer w0.254: R6.2 21.99,33.15 v1(21.6,33.15)
$1N8576: length 8.1
  Top Layer w0.254: U4.7 27.36,33.15 28.08,32.43 28.08,29.85 27.06,28.83 25.92,28.83 25.4,28.31 R9.1
$1N8615: length 8
  Top Layer w0.254: R10.1 23.25,28.83 23.76,29.34 26.81,29.34 27.57,30.1 27.57,31.67 27.36,31.88 U4.6

## Copper pours and planes (outline as drawn; the poured copper is in the pictures)
GND on Top Layer: 0.01,37.09 30.11,37.09 30.11,-0.13 0.01,-0.13
GND on Bottom Layer: 0.01,37.09 30.11,37.09 30.11,-0.13 0.01,-0.13

## Text on the board
Bottom Silkscreen Layer: ESP32 Tools | Letter | v1.0.2 | - | +
